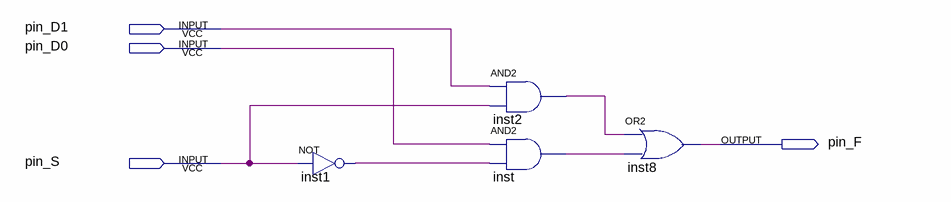
[diagram p0: schematic sheet]
// Quartus schematic Block1.bdf as structural Verilog: 4 symbols, 4 pins
module Block1 (
  input  pin_D1,
  input  pin_D0,
  input  pin_S,
  output pin_F
);

  wire inst1_out, inst2_out, inst_out;

  not inst1 (inst1_out, pin_S);
  and inst2 (inst2_out, pin_D1, pin_S);
  and inst (inst_out, pin_D0, inst1_out);
  or inst8 (pin_F, inst2_out, inst_out);
endmodule
